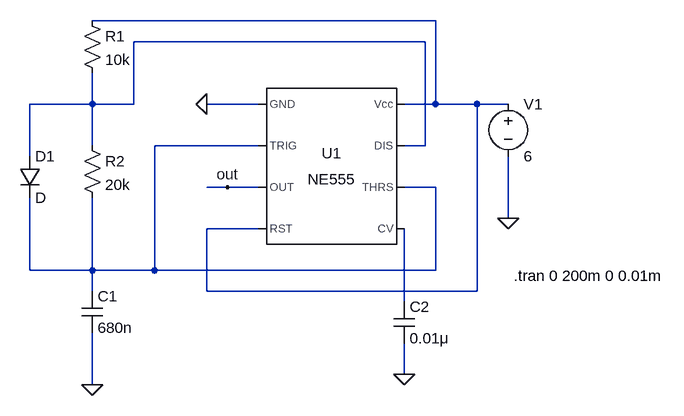
[diagram p0: schematic 555_low_duty.asc]
555_low_duty.asc, the LTspice schematic file:
Version 4
SHEET 1 1088 680
WIRE 608 48 80 48
WIRE 592 80 144 80
WIRE 80 176 80 128
WIRE 80 176 -16 176
WIRE 144 176 144 80
WIRE 144 176 80 176
WIRE 336 176 256 176
WIRE 608 176 608 48
WIRE 608 176 560 176
WIRE 672 176 608 176
WIRE 720 176 672 176
WIRE 80 240 80 176
WIRE 336 240 176 240
WIRE 592 240 592 80
WIRE 592 240 560 240
WIRE -16 256 -16 176
WIRE 288 304 256 304
WIRE 336 304 288 304
WIRE 608 304 560 304
WIRE 720 352 720 256
WIRE 336 368 256 368
WIRE -16 432 -16 320
WIRE 80 432 80 320
WIRE 80 432 -16 432
WIRE 176 432 176 240
WIRE 176 432 80 432
WIRE 608 432 608 304
WIRE 608 432 176 432
WIRE 80 464 80 432
WIRE 256 464 256 368
WIRE 672 464 672 176
WIRE 672 464 256 464
WIRE 560 480 560 368
WIRE 560 592 560 544
WIRE 80 608 80 528
FLAG 256 176 0
FLAG 560 592 0
FLAG 720 352 0
FLAG 80 608 0
FLAG 288 304 out
SYMBOL Misc/NE555 448 272 R0
SYMATTR InstName U1
SYMBOL res 64 32 R0
SYMATTR InstName R1
SYMATTR Value 10k
SYMBOL res 64 224 R0
SYMATTR InstName R2
SYMATTR Value 20k
SYMBOL cap 64 464 R0
SYMATTR InstName C1
SYMATTR Value 680n
SYMBOL cap 544 480 R0
SYMATTR InstName C2
SYMATTR Value 0.01μ
SYMBOL voltage 720 160 R0
SYMATTR InstName V1
SYMATTR Value 6
SYMBOL diode -32 256 R0
SYMATTR InstName D1
TEXT 728 440 Left 2 !.tran 0 200m 0 0.01m

The netlist it stands for:
* 555_low_duty.asc
XU1 0 N003 out N001 N004 N003 N002 N001 NE555  ; pins GND TRIG OUT RST CV THRS DIS Vcc
R1 N001 N002 10k
R2 N002 N003 20k
C1 N003 0 680n
C2 N004 0 0.01μ
V1 N001 0 6
D1 N002 N003 D
.model D D
.lib standard.dio
.tran 0 200m 0 0.01m
.lib NE555.sub
.backanno
.end